# Altium project UAV_States.PrjPcb
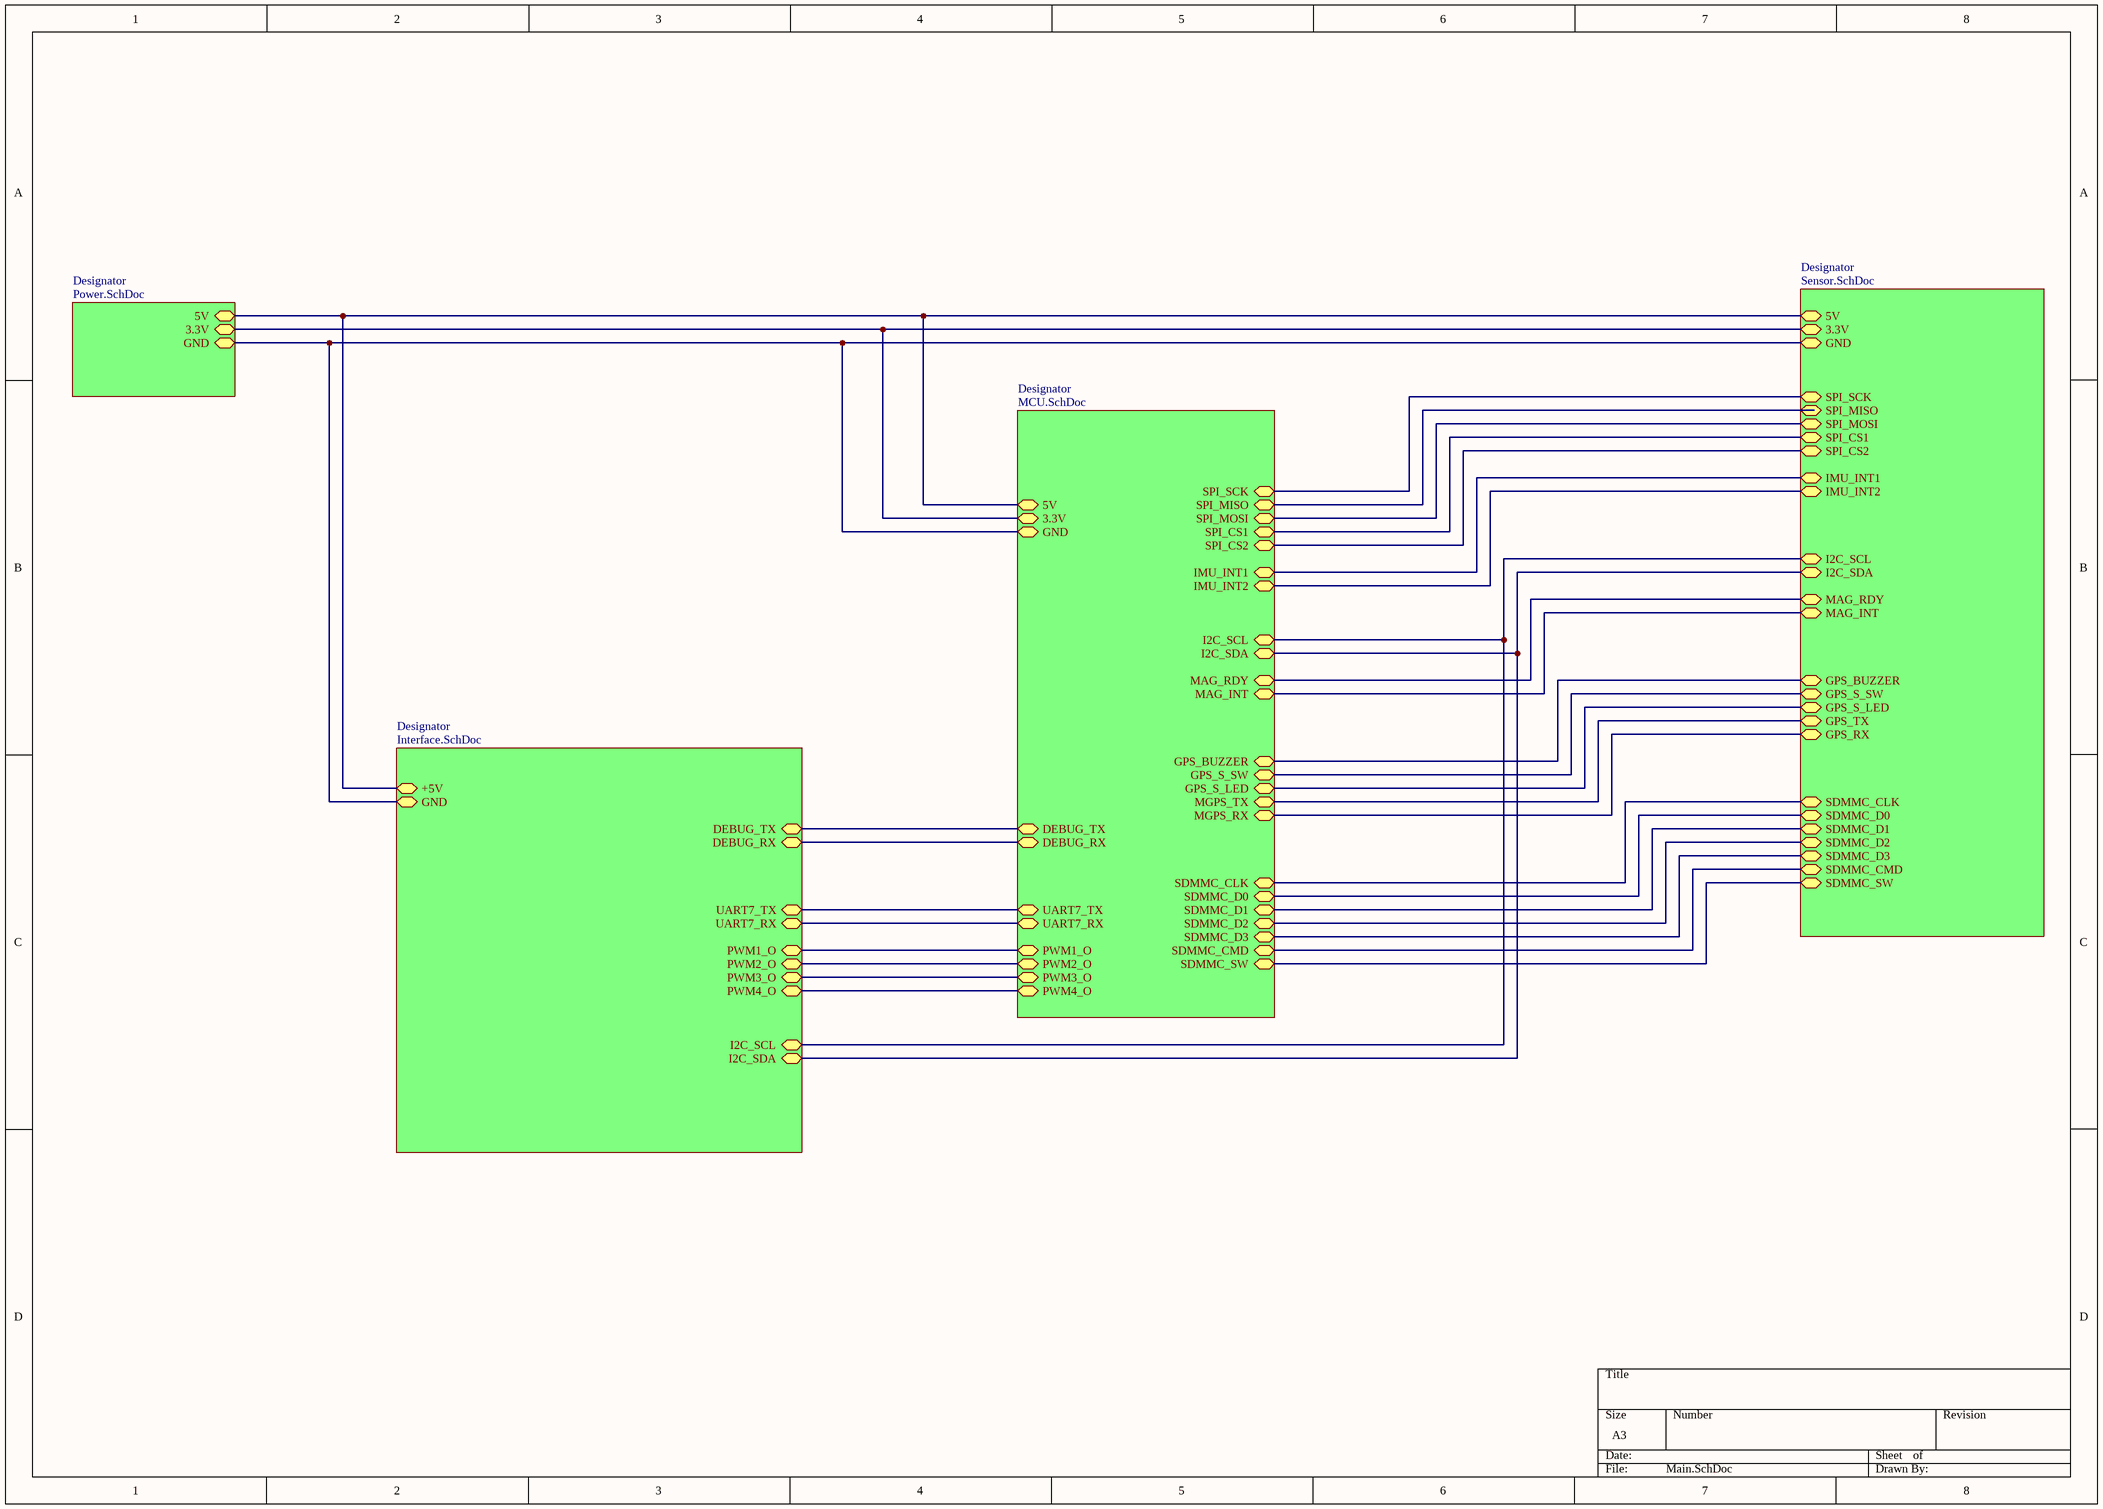
[diagram p0: Main.SchDoc]
5 sheets, 89 parts. Net scope: hierarchical (ports join the sheet entries above them; power ports are global).
Board file: UAV_States_PCB.PcbDoc
Sheets:
  Main.SchDoc
    Designator = MCU.SchDoc
    Designator = Power.SchDoc
    Designator = Sensor.SchDoc
    Designator = Interface.SchDoc

## Sheet Main.SchDoc
size A3; SheetNumber: 1; SheetTotal: 5

### Sub-sheets
Designator = MCU.SchDoc: IMU_INT2 (bidir), MGPS_RX (bidir), MGPS_TX (bidir), MAG_RDY (bidir), MAG_INT (bidir), GND (bidir), 3.3V (bidir), 5V (bidir), SPI_CS1 (bidir), SPI_SCK (bidir), SPI_MISO (bidir), SPI_MOSI (bidir), I2C_SDA (bidir), I2C_SCL (bidir), UART7_RX (bidir), GPS_BUZZER (bidir), UART7_TX (bidir), GPS_S_SW (bidir), DEBUG_TX (bidir), DEBUG_RX (bidir), SPI_CS2 (bidir), IMU_INT1 (bidir), GPS_S_LED (bidir), SDMMC_D0 (bidir), SDMMC_D1 (bidir), SDMMC_CLK (bidir), SDMMC_D3 (bidir), SDMMC_D2 (bidir), SDMMC_CMD (bidir), SDMMC_SW (bidir), PWM3_O (bidir), PWM4_O (bidir), PWM1_O (bidir), PWM2_O (bidir)
Designator = Power.SchDoc: GND (bidir), 3.3V (bidir), 5V (bidir)
Designator = Sensor.SchDoc: MAG_INT (bidir), SPI_MOSI (bidir), SPI_MISO (bidir), IMU_INT2 (bidir), I2C_SCL (bidir), SPI_SCK (bidir), I2C_SDA (bidir), MAG_RDY (bidir), GPS_TX (bidir), GPS_RX (bidir), SPI_CS2 (bidir), 5V (bidir), GND (bidir), 3.3V (bidir), GPS_S_SW (bidir), GPS_S_LED (bidir), GPS_BUZZER (bidir), SDMMC_CLK (bidir), SDMMC_D0 (bidir), SDMMC_D1 (bidir), SDMMC_D2 (bidir), SDMMC_D3 (bidir), SDMMC_CMD (bidir), SDMMC_SW (bidir), SPI_CS1 (bidir), IMU_INT1 (bidir)
Designator = Interface.SchDoc: GND (bidir), DEBUG_TX (bidir), DEBUG_RX (bidir), UART7_TX (bidir), UART7_RX (bidir), I2C_SDA (bidir), I2C_SCL (bidir), PWM1_O (bidir), PWM2_O (bidir), PWM3_O (bidir), PWM4_O (bidir), +5V (bidir)

### Nets
3.3V: sheet Designator/3.3V, sheet Designator/3.3V, sheet Designator/3.3V
+5V: sheet Designator/5V, sheet Designator/5V, sheet Designator/5V, sheet Designator/+5V
GND: sheet Designator/GND, sheet Designator/GND, sheet Designator/GND, sheet Designator/GND
Buzzer: sheet Designator/GPS_BUZZER, sheet Designator/GPS_BUZZER
DEBUG_RX: sheet Designator/DEBUG_RX, sheet Designator/DEBUG_RX
DEBUG_TX: sheet Designator/DEBUG_TX, sheet Designator/DEBUG_TX
GPS_RX: sheet Designator/MGPS_RX, sheet Designator/GPS_RX
GPS_S_LED: sheet Designator/GPS_S_LED, sheet Designator/GPS_S_LED
GPS_S_SW: sheet Designator/GPS_S_SW, sheet Designator/GPS_S_SW
GPS_TX: sheet Designator/MGPS_TX, sheet Designator/GPS_TX
I2C_SCL: sheet Designator/I2C_SCL, sheet Designator/I2C_SCL, sheet Designator/I2C_SCL
I2C_SDA: sheet Designator/I2C_SDA, sheet Designator/I2C_SDA, sheet Designator/I2C_SDA
IMU_INT1: sheet Designator/IMU_INT1, sheet Designator/IMU_INT1
IMU_INT2: sheet Designator/IMU_INT2, sheet Designator/IMU_INT2
MAG_INT: sheet Designator/MAG_INT, sheet Designator/MAG_INT
MAG_RDY: sheet Designator/MAG_RDY, sheet Designator/MAG_RDY
PWM1_O: sheet Designator/PWM1_O, sheet Designator/PWM1_O
PWM2_O: sheet Designator/PWM2_O, sheet Designator/PWM2_O
PWM3_O: sheet Designator/PWM3_O, sheet Designator/PWM3_O
PWM4_O: sheet Designator/PWM4_O, sheet Designator/PWM4_O
SDMMC_CLK: sheet Designator/SDMMC_CLK, sheet Designator/SDMMC_CLK
SDMMC_CMD: sheet Designator/SDMMC_CMD, sheet Designator/SDMMC_CMD
SDMMC_D0: sheet Designator/SDMMC_D0, sheet Designator/SDMMC_D0
SDMMC_D1: sheet Designator/SDMMC_D1, sheet Designator/SDMMC_D1
SDMMC_D2: sheet Designator/SDMMC_D2, sheet Designator/SDMMC_D2
SDMMC_D3: sheet Designator/SDMMC_D3, sheet Designator/SDMMC_D3
SDMMC_SW: sheet Designator/SDMMC_SW, sheet Designator/SDMMC_SW
SPI1_CS: sheet Designator/SPI_CS1, sheet Designator/SPI_CS1
SPI1_CS2: sheet Designator/SPI_CS2, sheet Designator/SPI_CS2
SPI1_MISO: sheet Designator/SPI_MISO, sheet Designator/SPI_MISO
SPI1_MOSI: sheet Designator/SPI_MOSI, sheet Designator/SPI_MOSI
SPI1_SCK: sheet Designator/SPI_SCK, sheet Designator/SPI_SCK
UART7_RX_O: sheet Designator/UART7_RX, sheet Designator/UART7_RX
UART7_TX_O: sheet Designator/UART7_TX, sheet Designator/UART7_TX

## Sheet MCU.SchDoc
size A3; SheetNumber: 3; SheetTotal: 5
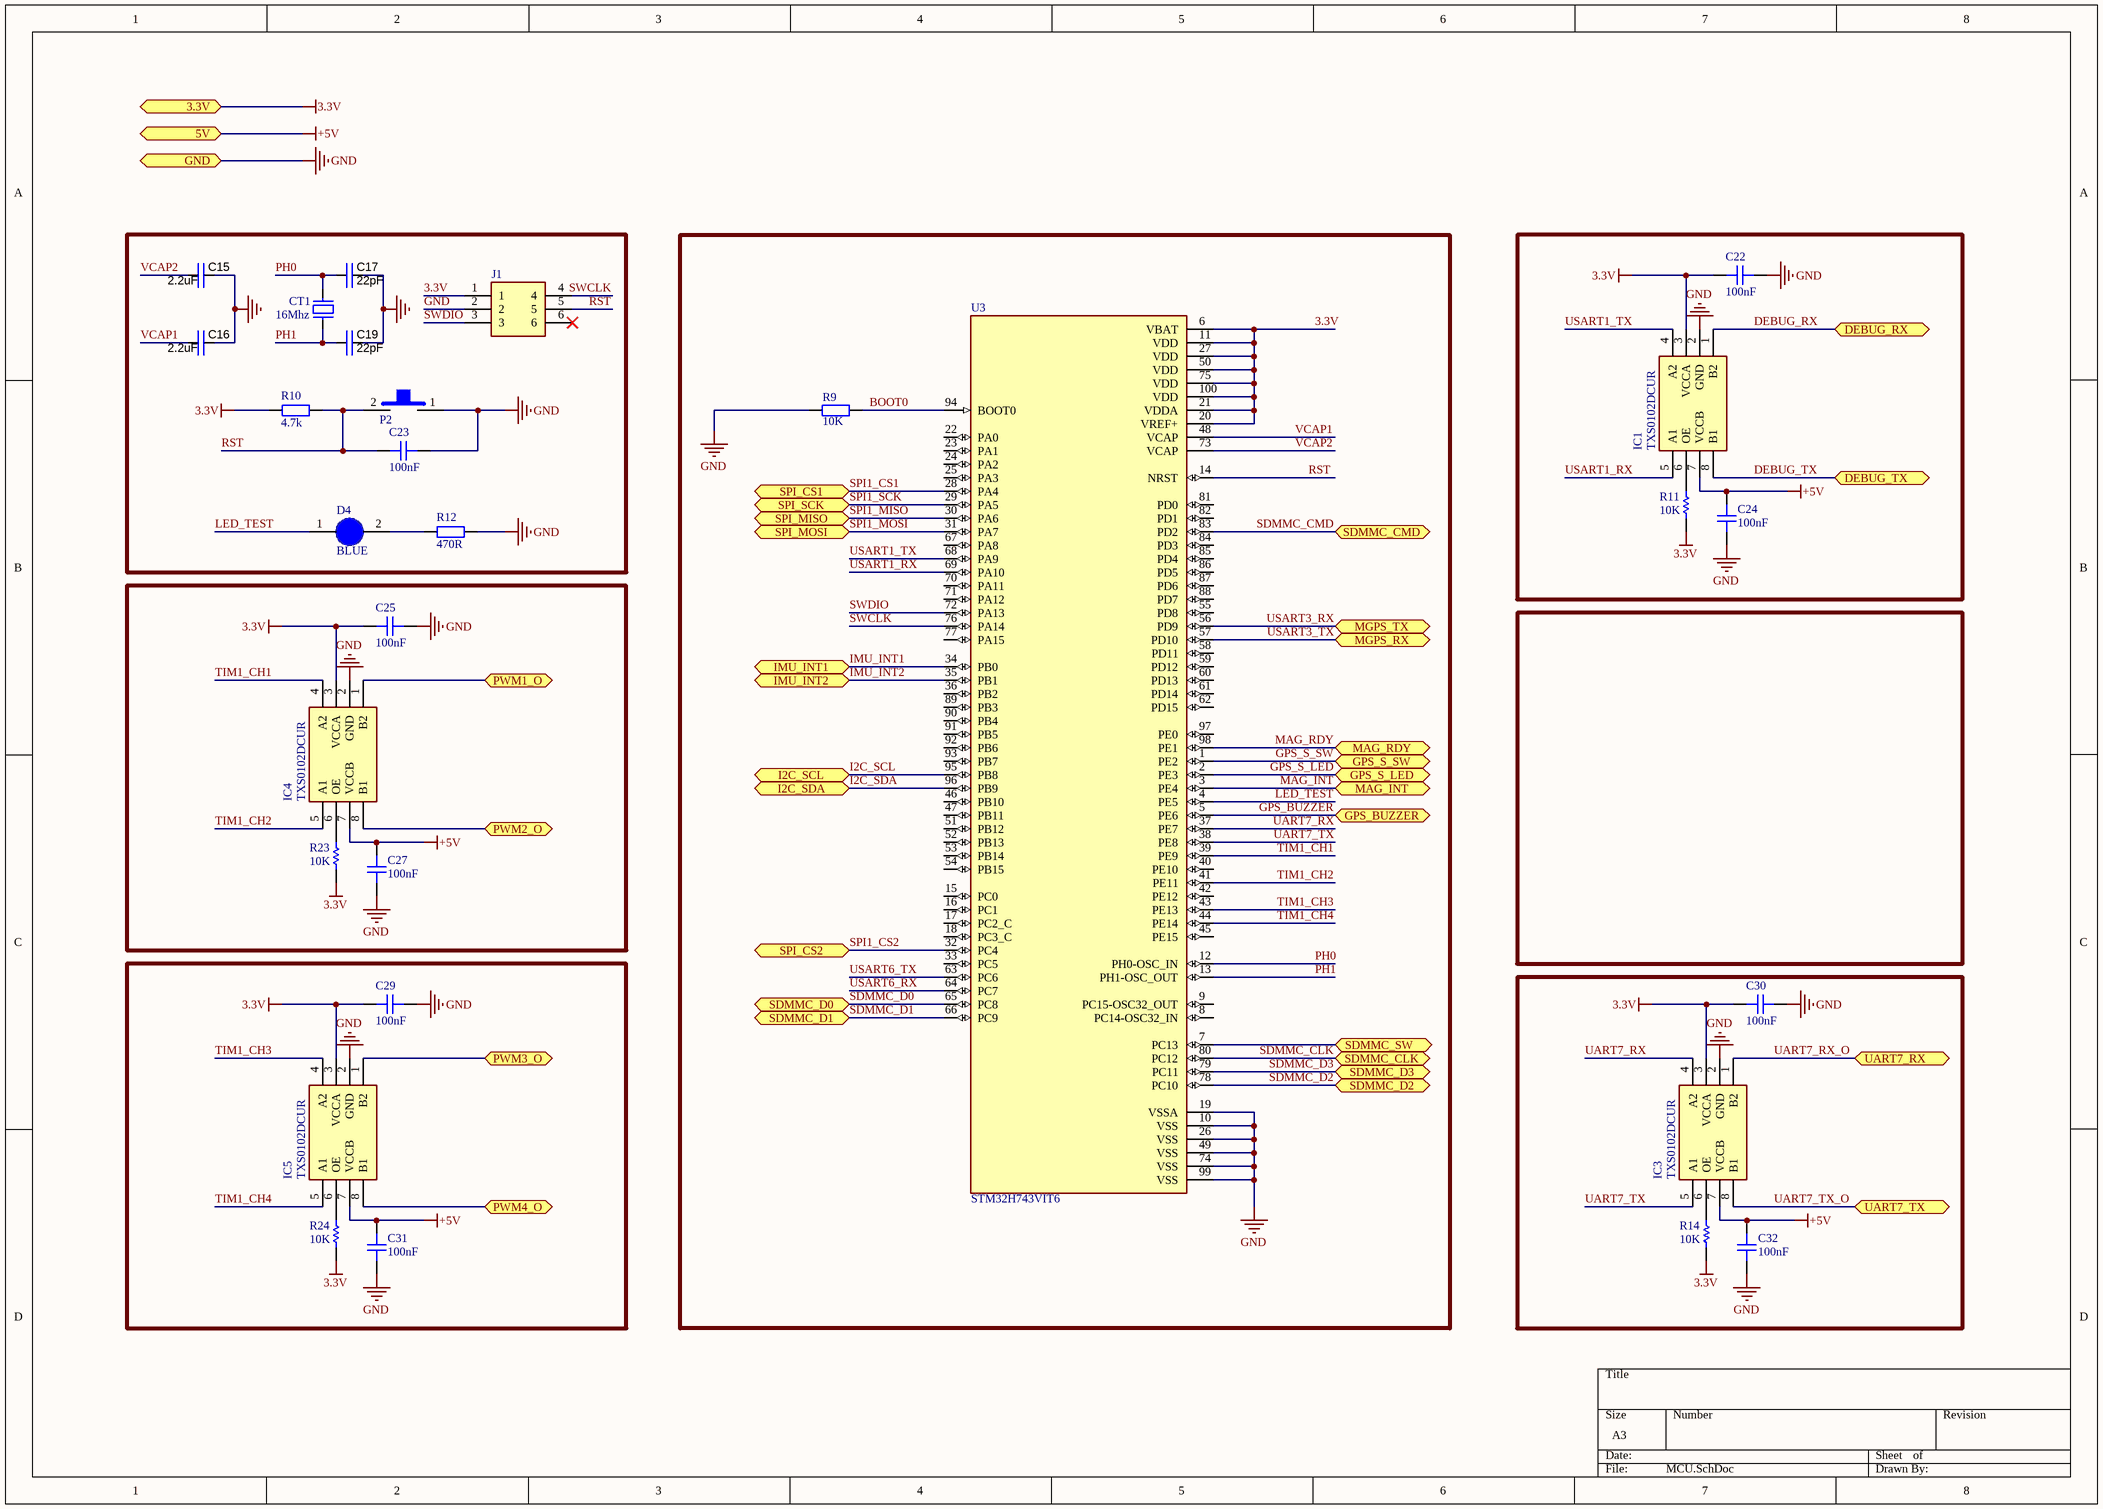
[diagram p1: MCU.SchDoc]

### Parts
C15  value 2.2uF  [CAPC-0402 (0506)]  (hidden comment: Tụ gốm)
C16  value 2.2uF  [CAPC-0402 (0506)]  (hidden comment: Tụ gốm)
C17  22pF  [CAPC-0402 (1005)]
C19  22pF  [CAPC-0402 (1005)]
C22  100nF  [CAP_0402]
C23  100nF  [CAP_0402]
C24  100nF  [CAP_0402]
C25  100nF  [CAP_0402]
C27  100nF  [CAP_0402]
C29  100nF  [CAP_0402]
C30  100nF  [CAP_0402]
C31  100nF  [CAP_0402]
C32  100nF  [CAP_0402]
CT1  16Mhz  [CRYSTAL-SMD5032]
D4  BLUE  [LED_0603_BLUE]
IC1  TXS0102DCUR  [TXS0102DCUR]
IC3  TXS0102DCUR  [TXS0102DCUR]
IC4  TXS0102DCUR  [TXS0102DCUR]
IC5  TXS0102DCUR  [TXS0102DCUR]
J1  SM06B-SRSS-TB__LF__SN_  [SM06B-SRSS-TB]  (value not drawn)
P2  (no value)  [SW 2P SMD]
R9  10K  [RESC-0402 (1005)]
R10  4.7k  [RESC-0402 (1005)]
R11  10K  [RESC-0402 (1005)]
R12  470R  [RESC-0402 (1005)]
R14  10K  [RESC-0402 (1005)]
R23  10K  [RESC-0402 (1005)]
R24  10K  [RESC-0402 (1005)]
U3  STM32H743VIT6  [QFP50P1600X1600X160-100N]

### Ports
3.3V (bidir), 5V (bidir), DEBUG_RX (bidir), DEBUG_TX (bidir), GND (bidir), GPS_BUZZER (bidir), GPS_S_LED (bidir), GPS_S_SW (bidir), I2C_SCL (bidir), I2C_SDA (bidir), IMU_INT1 (bidir), IMU_INT2 (bidir), MAG_INT (bidir), MAG_RDY (bidir), MGPS_RX (bidir), MGPS_TX (bidir), PWM1_O (bidir), PWM2_O (bidir), PWM3_O (bidir), PWM4_O (bidir), SDMMC_CLK (bidir), SDMMC_CMD (bidir), SDMMC_D0 (bidir), SDMMC_D1 (bidir), SDMMC_D2 (bidir), SDMMC_D3 (bidir), SDMMC_SW (bidir), SPI_CS1 (bidir), SPI_CS2 (bidir), SPI_MISO (bidir), SPI_MOSI (bidir), SPI_SCK (bidir), UART7_RX (bidir), UART7_TX (bidir)

### Nets
3.3V: C22.2 C25.2 C29.2 C30.2 IC1.3(VCCA) IC3.3(VCCA) IC4.3(VCCA) IC5.3(VCCA) J1.1 R10.2 R11.1 R14.1 R23.1 R24.1 U3.6(VBAT) U3.11(VDD) U3.20(VREF+) U3.21(VDDA) U3.27(VDD) U3.50(VDD) U3.75(VDD) U3.100(VDD) ; port 3.3V
+5V: C24.2 C27.2 C31.2 C32.2 IC1.7(VCCB) IC3.7(VCCB) IC4.7(VCCB) IC5.7(VCCB) ; port 5V
GND: C15.2 C16.2 C17.2 C19.2 C22.1 C23.1 C24.1 C25.1 C27.1 C29.1 C30.1 C31.1 C32.1 IC1.2(GND) IC3.2(GND) IC4.2(GND) IC5.2(GND) J1.2 P2.1 R9.1 R12.1 U3.10(VSS) U3.19(VSSA) U3.26(VSS) U3.49(VSS) U3.74(VSS) U3.99(VSS) ; port GND
BOOT0: R9.2 U3.94(BOOT0)
DEBUG_RX: IC1.1(B2) ; port DEBUG_RX
DEBUG_TX: IC1.8(B1) ; port DEBUG_TX
GPS_BUZZER: U3.5(PE6) ; port GPS_BUZZER  [project net Buzzer]
GPS_S_LED: U3.2(PE3) ; port GPS_S_LED
GPS_S_SW: U3.1(PE2) ; port GPS_S_SW
I2C_SCL: U3.95(PB8) ; port I2C_SCL
I2C_SDA: U3.96(PB9) ; port I2C_SDA
IMU_INT1: U3.34(PB0) ; port IMU_INT1
IMU_INT2: U3.35(PB1) ; port IMU_INT2
LED_TEST: D4.1(A) U3.4(PE5)
MAG_INT: U3.3(PE4) ; port MAG_INT
MAG_RDY: U3.98(PE1) ; port MAG_RDY
PH0: C17.1 CT1.2 U3.12(PH0-OSC_IN)
PH1: C19.1 CT1.1 U3.13(PH1-OSC_OUT)
PWM1_O: IC4.1(B2) ; port PWM1_O
PWM2_O: IC4.8(B1) ; port PWM2_O
PWM3_O: IC5.1(B2) ; port PWM3_O
PWM4_O: IC5.8(B1) ; port PWM4_O
RST: C23.2 J1.5 P2.2 R10.1 U3.14(NRST)
SDMMC_CLK: U3.80(PC12) ; port SDMMC_CLK
SDMMC_CMD: U3.83(PD2) ; port SDMMC_CMD
SDMMC_D0: U3.65(PC8) ; port SDMMC_D0
SDMMC_D1: U3.66(PC9) ; port SDMMC_D1
SDMMC_D2: U3.78(PC10) ; port SDMMC_D2
SDMMC_D3: U3.79(PC11) ; port SDMMC_D3
SDMMC_SW: U3.7(PC13) ; port SDMMC_SW
SPI1_CS1: U3.28(PA4) ; port SPI_CS1  [project net SPI1_CS]
SPI1_CS2: U3.32(PC4) ; port SPI_CS2
SPI1_MISO: U3.30(PA6) ; port SPI_MISO
SPI1_MOSI: U3.31(PA7) ; port SPI_MOSI
SPI1_SCK: U3.29(PA5) ; port SPI_SCK
SWCLK: J1.4 U3.76(PA14)
SWDIO: J1.3 U3.72(PA13)
TIM1_CH1: IC4.4(A2) U3.39(PE9)
TIM1_CH2: IC4.5(A1) U3.41(PE11)
TIM1_CH3: IC5.4(A2) U3.43(PE13)
TIM1_CH4: IC5.5(A1) U3.44(PE14)
UART7_RX: IC3.4(A2) U3.37(PE7)
UART7_RX_O: IC3.1(B2) ; port UART7_RX
UART7_TX: IC3.5(A1) U3.38(PE8)
UART7_TX_O: IC3.8(B1) ; port UART7_TX
USART1_RX: IC1.5(A1) U3.69(PA10)
USART1_TX: IC1.4(A2) U3.68(PA9)
USART3_RX: U3.56(PD9) ; port MGPS_TX  [project net GPS_TX]
USART3_TX: U3.57(PD10) ; port MGPS_RX  [project net GPS_RX]
USART6_RX: U3.64(PC7)
USART6_TX: U3.63(PC6)
VCAP1: C16.1 U3.48(VCAP)
VCAP2: C15.1 U3.73(VCAP)
NetD4_2: D4.2(K) R12.2
NetIC1_6: IC1.6(OE) R11.2
NetIC3_6: IC3.6(OE) R14.2
NetIC4_6: IC4.6(OE) R23.2
NetIC5_6: IC5.6(OE) R24.2

Not connected (* = marked no-connect by the designer): J1 6*; U3 8(PC14-OSC32_IN) 9(PC15-OSC32_OUT) 15(PC0) 16(PC1) 17(PC2_C) 18(PC3_C) 22(PA0) 23(PA1) 24(PA2) 25(PA3) 33(PC5) 36(PB2) 40(PE10) 42(PE12) 45(PE15) 46(PB10) 47(PB11) 51(PB12) 52(PB13) 53(PB14) 54(PB15) 55(PD8) 58(PD11) 59(PD12) 60(PD13) 61(PD14) 62(PD15) 67(PA8) 70(PA11) 71(PA12) 77(PA15) 81(PD0) 82(PD1) 84(PD3) 85(PD4) 86(PD5) 87(PD6) 88(PD7) 89(PB3) 90(PB4) 91(PB5) 92(PB6) 93(PB7) 97(PE0)

### Library data of the parts
C15-C17 C19 = CAP C_0603: Capacitor SMD Cer 470nF 10% 16V X7R 0603; Manufacturer 1: Murata Electronics North America; Manufacturer Part Number 1: GRM188R71C474KA88D; Ratings: 16V; X7R; Material: ceramic; SCDType: spec; Package / Case: 0603 (1608 metric); Tolerance: ±10%; Manufacturer 2: TDK Corporation; Manufacturer Part Number 2: C1608X7R1C474K; Supplier 1: Digi-Key; Supplier Part Number 1: 490-3295-2-ND; Supplier 2: Digi-Key; Supplier Part Number 2: 445-5192-2-ND; Supplier 3: Digi-Key; Supplier Part Number 3: 587-1250-2-ND; Manufacturer 3: Taiyo Yuden; Manufacturer Part Number 3: EMK107B7474KA-T; Manufacturer 4: Samsung; Manufacturer Part Number 4: CL10B474KONE; ComponentLink1URL: http://psearch.murata.com/capacitor/product/GRM188R71C474KA88#.pdf; ComponentLink1Description: http://psearch.murata.com/capacitor/product/GRM188R71C474KA88#.pdf; ComponentLink2URL: http://product.tdk.com/capacitor/mlcc/en/documents/mlcc_commercial_general_en.pdf; ComponentLink2Description: http://product.tdk.com/capacitor/mlcc/en/documents/mlcc_commercial_general_en.pdf; ComponentLink3URL: http://www.yuden.co.jp/or/product/category/capacitor/EMK107B7474KA-T.pdf; ComponentLink3Description: http://www.yuden.co.jp/or/product/category/capacitor/EMK107B7474KA-T.pdf
  C17 C19: Value: 22pF
C22-C25 C27 C29-C32 = CAP_0402: 0402 100nF 16V X7R; Manufacturer: *; Manufacturer Part Number: *; Distributor Link: *; LCSC: *; Rating: *; Dielectric: *
CT1 = CRYSTAL: CL = 16 - 18pF; Value: 4Mhz
D4 = LED BLUE 0603: LED BLUE 0603 SMD; Solder: SMT; Value: BLUE; Category: *
IC1 IC3-IC5 = TXS0102DCUR: Integrated Circuit; Manufacturer_Name: Texas Instruments; Datasheet Link: https://datasheet.datasheetarchive.com/originals/distributors/SFDatasheet-7/sf-000145437.pdf; Height: 0.9mm; Manufacturer_Part_Number: TXS0102DCUR; Mouser Part Number: 595-TXS0102DCUR; Mouser Price/Stock: https://www.mouser.co.uk/ProductDetail/Texas-Instruments/TXS0102DCUR?qs=dB0LedT%252BmmBcQ3I%2Fs9XEDA%3D%3D; Arrow Part Number: TXS0102DCUR; Arrow Price/Stock: https://www.arrow.com/en/products/txs0102dcur/texas-instruments?region=nac
J1 = SM06B-SRSS-TB__LF__SN_: Connector; Manufacturer_Name: JST (JAPAN SOLDERLESS TERMINALS); Manufacturer_Part_Number: SM06B-SRSS-TB (LF)(SN); Datasheet Link: http://uk.rs-online.com/web/p/products/5468827
P2 = Button 2 SMD: SMD Mini Push Button Switch 2 Pin 3x6x2.7mm; MPN: SMD Mini Push Button 2 SMD; Link: https://ram-e-shop.com/product/press2pin-smd/
R9 = RC0603FR-0710KL: RES SMD 10K OHM 1% 1/10W 0603; CompanyID: VT-00328; Solder: SMT; MPN: RC0603FR-0710KL; Value: 10K; Category: RESISTOR
R10 = Tro 0603 5% 4.7k: Dán; Don_Vi: Con; So_Chan: 2; Ten_Linh_Kien: Trở 0603 5% 4.7k; Ma_Hang: MH006327; Chung_Loai: Dán; Kieu_Chan: *
R11 R14 R23 R24 = Res Semi: Semiconductor Resistor; Value: 1K; Published: 8-Jun-2000; LatestRevisionDate: 17-Jul-2002; LatestRevisionNote: Re-released for DXP Platform.; PackageReference: AXIAL-0.5; Publisher: Altium Limited; PackageDescription: Axial Device, Thru-Hole; 2 Leads; 0.5 in Pin Spacing
R12 = Tro 0603 5% 470R: Dán; Don_Vi: Con; So_Chan: 2; Ten_Linh_Kien: Trở 0603 5% 470R; Ma_Hang: MH006328; Chung_Loai: Dán; Kieu_Chan: *
U3 = STM32H743VIT6: ARMÂ® CortexÂ®-M7 STM32H7 Microcontroller IC 32-Bit Single-Core 480MHz 2MB (2M x 8) FLASH 100-LQFP (14x14); MF: STMicroelectronics; SnapEDA_Link: https://www.snapeda.com/parts/STM32H743VIT6/STMicroelectronics/view-part/?ref=snap; Package: LQFP-100 STMicroelectronics; Value: *; MP: STM32H743VIT6; Check_prices: https://www.snapeda.com/parts/STM32H743VIT6/STMicroelectronics/view-part/?ref=eda

## Sheet Power.SchDoc
size A3; SheetNumber: 2; SheetTotal: 5
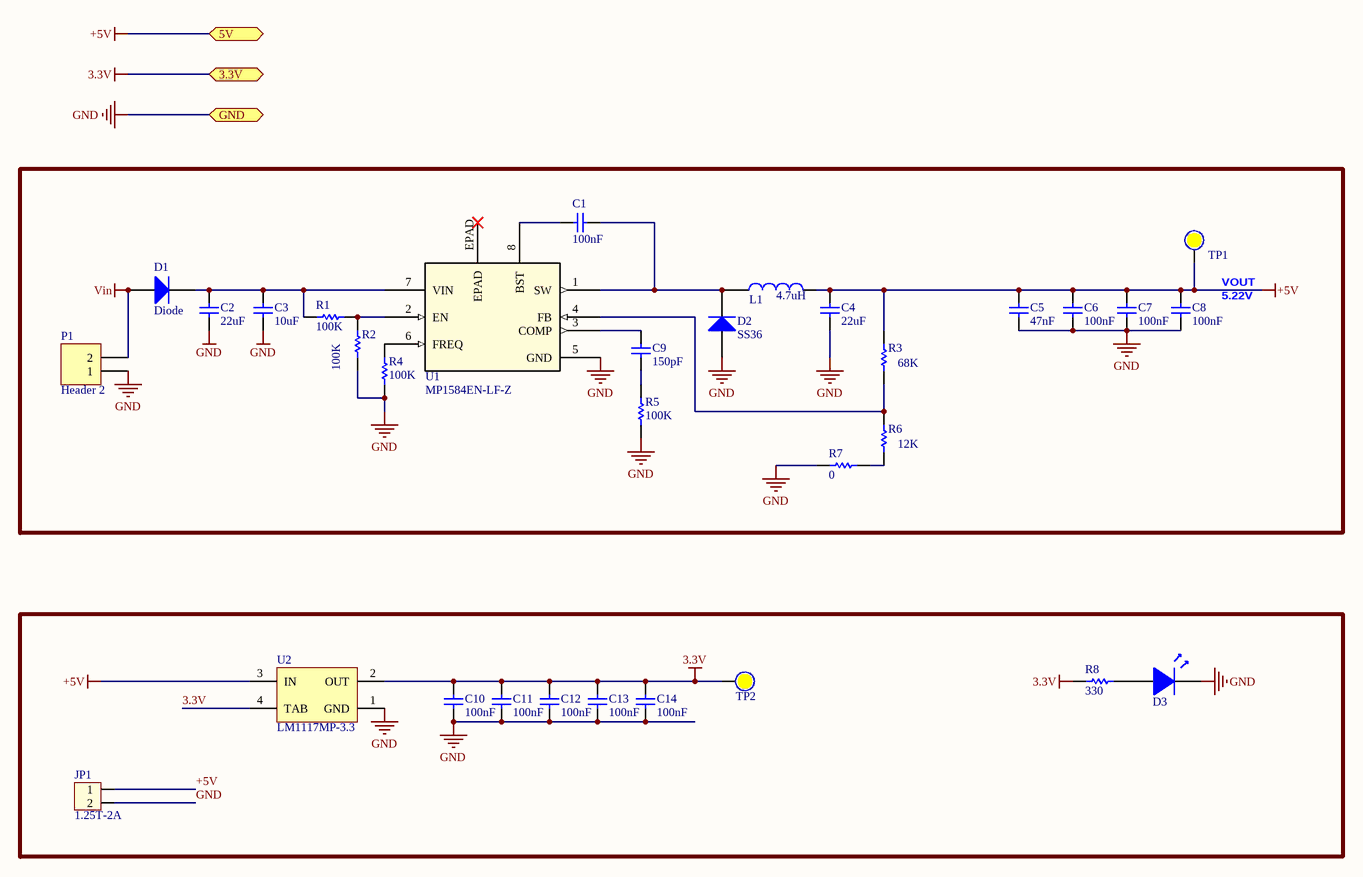
[diagram p2: Power.SchDoc]

### Parts
C1  100nF  [CAPC-0402 (0506)]
C2  22uF  [2012[0805]]
C3  10uF  [2012[0805]]
C4  22uF  [2012[0805]]
C5  47nF  [2012[0805]]
C6  100nF  [CAPC-0402 (0506)]
C7  100nF  [CAPC-0402 (0506)]
C8  100nF  [CAPC-0402 (0506)]
C9  150pF  [1005[0402]]
C10  100nF  [CAPC-0402 (0506)]
C11  100nF  [CAPC-0402 (0506)]
C12  100nF  [CAPC-0402 (0506)]
C13  100nF  [CAPC-0402 (0506)]
C14  100nF  [CAPC-0402 (0506)]
D1  Diode  [DIODE SMD]
D2  SS36  [SMB]
D3  LED  [LED_0603_BLUE]  (value not drawn)
JP1  1.25T-2A  [BM02B-GHS]
L1  4.7uH  [INDUCTOR SMD 7x7]
P1  Header 2  [BM02B-GHS]
R1  100K  [1005[0402]]
R2  100K  [1005[0402]]
R3  68K  [1005[0402]]
R4  100K  [1005[0402]]
R5  100K  [1005[0402]]
R6  12K  [1005[0402]]
R7  0  [1005[0402]]
R8  330  [RESC-0402 (1005)]
TP1  (no value)  [Test Point 1 MM]  (no BOM)
TP2  (no value)  [Test Point 1 MM]  (no BOM)
U1  MP1584EN-LF-Z  [SOIC8E_MPS]
U2  LM1117MP-3.3  [MP04A_N]

### Ports
3.3V (bidir), 5V (bidir), GND (bidir)

### Nets
3.3V: C10.2 C11.2 C12.2 C13.2 C14.2 R8.2 TP2.0 U2.2(OUT) U2.4(TAB) ; port 3.3V
+5V: C4.2 C5.2 C6.2 C7.2 C8.2 JP1.1 L1.2 R3.2 TP1.0 U2.3(IN) ; port 5V
GND: C2.1 C3.1 C4.1 C5.1 C6.1 C7.1 C8.1 C10.1 C11.1 C12.1 C13.1 C14.1 D2.1(A) D3.2(K) JP1.2 P1.1 R2.1 R4.2 R5.2 R7.1 U1.5(GND) U2.1(GND) ; port GND
Vin: D1.1(A) P1.2
NetC1_1: C1.1 D2.2(K) L1.1 U1.1(SW)
NetC1_2: C1.2 U1.8(BST)
NetC2_2: C2.2 C3.2 D1.2(K) R1.2 U1.7(VIN)
NetC9_1: C9.1 R5.1
NetC9_2: C9.2 U1.3(COMP)
NetD3_1: D3.1(A) R8.1
NetR1_1: R1.1 R2.2 U1.2(EN)
NetR3_1: R3.1 R6.1 U1.4(FB)
NetR4_1: R4.1 U1.6(FREQ)
NetR6_2: R6.2 R7.2

Not connected (* = marked no-connect by the designer): U1 EPAD*

### Notes on the sheet
- 5.22V
- VOUT

### Library data of the parts
C1-C14 = TU THUONG
D2 = Diode: Default Diode; Published: 8-Jun-2000; LatestRevisionDate: 17-Jul-2002; LatestRevisionNote: Re-released for DXP Platform.; PackageDocument: Sep-1996; PackageReference: SMC; Publisher: Altium Limited; Code_JEDEC: DO-214-AB
JP1 = Header 1_2.54_2P: Cắm; Chung_Loai: Cắm
L1 = Inductor SMD
P1 = Header 2: Header, 2-Pin; LatestRevisionDate: 17-Jul-2002; LatestRevisionNote: Re-released for DXP Platform.; Publisher: Altium Limited
R1-R7 = Res1: Resistor; Value: 1k; Published: 8-Jun-2000; LatestRevisionDate: 17-Jul-2002; LatestRevisionNote: Re-released for DXP Platform.; PackageReference: AXIAL-0.3; Publisher: Altium Limited; PackageDescription: Axial Device, Thru-Hole; 2 Leads; 0.3 in Pin Spacing
R8 = Res Semi: Semiconductor Resistor; Published: 8-Jun-2000; LatestRevisionDate: 17-Jul-2002; LatestRevisionNote: Re-released for DXP Platform.; PackageReference: AXIAL-0.5; Publisher: Altium Limited; PackageDescription: Axial Device, Thru-Hole; 2 Leads; 0.5 in Pin Spacing; Value: 330
TP1 TP2 = Test Point: Solder: NF
U1 = MP1584EN-LF-Z: No Description Available; Mfr_Name: Monolithic Power Systems; Copyright: Copyright (C) 2023 Ultra Librarian. All rights reserved.; Manufacturer_Part_Number: MP1584EN-LF-Z; RefDes: RefDes; Type: DEV
U2 = LM1117MP-3.3: 800mA Low-Dropout Linear Regulator, 4-pin SOT-223; Manufacturer: National Semiconductor; PackageTopMarking: XYTT*N05A; PowerWise: N; CompType: LDO IC; Published: 4-Dec-2008; DatasheetVersion: Apr-2006; PackageVersion: revB, Apr-2003; PackageReference: MP04A; Publisher: Altium Limited; PackageDescription: Molded SOT-223, 6.50 x 3.56 x 1.6mm Body, 4 Lead, 2.3mm Pitch; Supplier 1: Farnell; Supplier Part Number 1: 9778195; Supplier 2: Farnell; Supplier Part Number 2: 9778195RL; PartNumber: LM1117MP-3.3; RoHS: N; PinCount: 4; Code_JEDEC: TO-261-AA; Code_IPC: SOT223-4; ComponentLink1Description: LM1117 Datasheet; ComponentLink1URL: http://www.national.com/ds/LM/LM1117.pdf; ComponentLink2Description: LM1117 Web Page; ComponentLink2URL: http://www.national.com/pf/LM/LM1117.html; ComponentLink3Description: MP04A Package Page; ComponentLink3URL: http://www.national.com/packaging/folders/mp04a.html

## Sheet Sensor.SchDoc
size A3; SheetNumber: 4; SheetTotal: 5
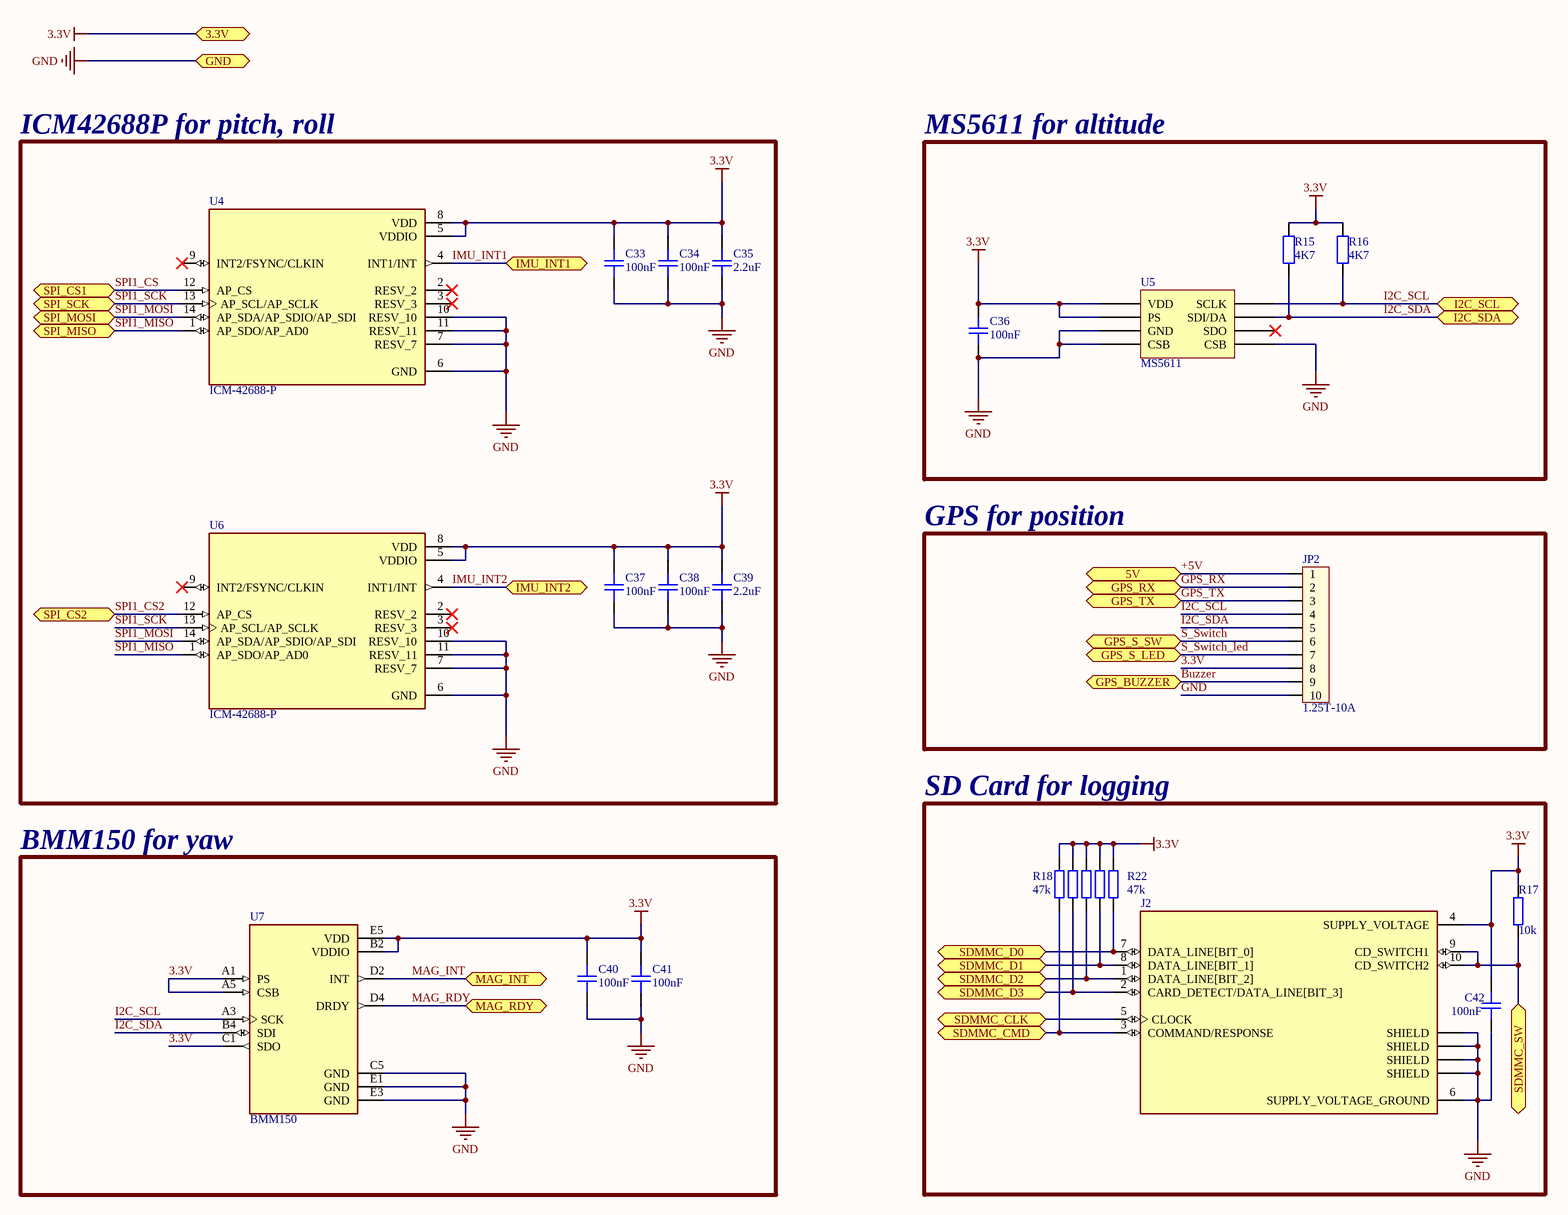
[diagram p3: Sensor.SchDoc]

### Parts
C33  100nF  [CAP_0402]
C34  100nF  [CAP_0402]
C35  2.2uF  [CAP_0603]
C36  100nF  [CAP_0402]
C37  100nF  [CAP_0402]
C38  100nF  [CAP_0402]
C39  2.2uF  [CAP_0603]
C40  100nF  [CAP_0402]
C41  100nF  [CAP_0402]
C42  100nF  [CAP_0402]
J2  (no value)  [AMPHENOL_1140084168]
JP2  1.25T-10A  [BM10B-GHS-TBT]
R15  4K7  [RESC-0402 (1005)]
R16  4K7  [RESC-0402 (1005)]
R17  10k  [RES_0402]
R18  47k  [RES_0402]
R19  47k  [RES_0402]  (value not drawn)
R20  47k  [RES_0402]  (value not drawn)
R21  47k  [RES_0402]  (value not drawn)
R22  47k  [RES_0402]
U4  ICM-42688-P  [PQFN50P300X250X97-14N]
U5  MS5611  [MS5611_1]
U6  ICM-42688-P  [PQFN50P300X250X97-14N]
U7  BMM150  [XDCR_BMM150]

### Blocks framed on the sheet
ICM42688P for pitch, roll: C33-C35 C37-C39 U4 U6
MS5611 for altitude: C36 R15 R16 U5
GPS for position: JP2
SD Card for logging: C42 J2 R17-R22
BMM150 for yaw: C40 C41 U7

### Ports
3.3V (bidir), 5V (bidir), GND (bidir), GPS_BUZZER (bidir), GPS_RX (bidir), GPS_S_LED (bidir), GPS_S_SW (bidir), GPS_TX (bidir), I2C_SCL (bidir), I2C_SDA (bidir), IMU_INT1 (bidir), IMU_INT2 (bidir), MAG_INT (bidir), MAG_RDY (bidir), SDMMC_CLK (bidir), SDMMC_CMD (bidir), SDMMC_D0 (bidir), SDMMC_D1 (bidir), SDMMC_D2 (bidir), SDMMC_D3 (bidir), SDMMC_SW (bidir), SPI_CS1 (bidir), SPI_CS2 (bidir), SPI_MISO (bidir), SPI_MOSI (bidir), SPI_SCK (bidir)

### Nets
3.3V: C33.2 C34.2 C35.2 C36.2 C37.2 C38.2 C39.2 C40.2 C41.2 C42.2 J2.4(SUPPLY_VOLTAGE) JP2.8 R15.2 R16.2 R17.2 R18.2 R19.2 R20.2 R21.2 R22.2 U4.5(VDDIO) U4.8(VDD) U5.128(VDD) U5.129(PS) U6.5(VDDIO) U6.8(VDD) U7.A1(PS) U7.A5(CSB) U7.B2(VDDIO) U7.C1(SDO) U7.E5(VDD) ; port 3.3V
+5V: JP2.1 ; port 5V
GND: C33.1 C34.1 C35.1 C36.1 C37.1 C38.1 C39.1 C40.1 C41.1 C42.1 J2.6(SUPPLY_VOLTAGE_GROUND) J2.S1(SHIELD) J2.S2(SHIELD) J2.S3(SHIELD) J2.S4(SHIELD) JP2.10 U4.6(GND) U4.7(RESV_7) U4.10(RESV_10) U4.11(RESV_11) U5.130(GND) U5.131(CSB) U5.132(CSB) U6.6(GND) U6.7(RESV_7) U6.10(RESV_10) U6.11(RESV_11) U7.C5(GND) U7.E1(GND) U7.E3(GND) ; port GND
Buzzer: JP2.9 ; port GPS_BUZZER
GPS_RX: JP2.2 ; port GPS_RX
GPS_TX: JP2.3 ; port GPS_TX
I2C_SCL: JP2.4 R16.1 U5.135(SCLK) U7.A3(SCK) ; port I2C_SCL
I2C_SDA: JP2.5 R15.1 U5.134(SDI/DA) U7.B4(SDI) ; port I2C_SDA
IMU_INT1: U4.4(INT1/INT) ; port IMU_INT1
IMU_INT2: U6.4(INT1/INT) ; port IMU_INT2
MAG_INT: U7.D2(INT) ; port MAG_INT
MAG_RDY: U7.D4(DRDY) ; port MAG_RDY
S_Switch: JP2.6 ; port GPS_S_SW  [project net GPS_S_SW]
S_Switch_led: JP2.7 ; port GPS_S_LED  [project net GPS_S_LED]
SDMMC_CLK: J2.5(CLOCK) ; port SDMMC_CLK
SDMMC_CMD: J2.3(COMMAND/RESPONSE) R18.1 ; port SDMMC_CMD
SDMMC_D0: J2.7(DATA_LINE[BIT_0]) R22.1 ; port SDMMC_D0
SDMMC_D1: J2.8(DATA_LINE[BIT_1]) R21.1 ; port SDMMC_D1
SDMMC_D2: J2.1(DATA_LINE[BIT_2]) R20.1 ; port SDMMC_D2
SDMMC_D3: J2.2(CARD_DETECT/DATA_LINE[BIT_3]) R19.1 ; port SDMMC_D3
SDMMC_SW: J2.9(CD_SWITCH1) J2.10(CD_SWITCH2) R17.1 ; port SDMMC_SW
SPI1_CS: U4.12(AP_CS) ; port SPI_CS1
SPI1_CS2: U6.12(AP_CS) ; port SPI_CS2
SPI1_MISO: U4.1(AP_SDO/AP_AD0) U6.1(AP_SDO/AP_AD0) ; port SPI_MISO
SPI1_MOSI: U4.14(AP_SDA/AP_SDIO/AP_SDI) U6.14(AP_SDA/AP_SDIO/AP_SDI) ; port SPI_MOSI
SPI1_SCK: U4.13(AP_SCL/AP_SCLK) U6.13(AP_SCL/AP_SCLK) ; port SPI_SCK

Not connected (* = marked no-connect by the designer): U4 2(RESV_2)* 3(RESV_3)* 9(INT2/FSYNC/CLKIN)*; U5 133(SDO)*; U6 2(RESV_2)* 3(RESV_3)* 9(INT2/FSYNC/CLKIN)*

### Library data of the parts
C33 C34 C36-C38 C40-C42 = CAP_0402: 0402 100nF 16V X7R; Manufacturer: *; Manufacturer Part Number: *; Distributor Link: *; LCSC: *; Rating: *; Dielectric: *
C35 C39 = CAP_0603: 0603 2.2uF 10V X7R; Manufacturer: *; Manufacturer Part Number: *; Distributor Link: *; LCSC: *; Rating: *; Dielectric: *
J2 = 1140084168: MEMORY CARD CONNECTOR, MICROSD, 8 POSITION, FULL REEL; Memory / Card Type:MicroSD; Insert & Eject Mechanism:Push-Pull; No. of Contacts:8Contacts; Contact Material:Copper Alloy; Contact Plating:Gold Plated Contacts; Product Range:- RoHS Compliant: Yes; MF: amphenol communications solutions; MP: 114-00841-68..; SnapEDA_Link: https://www.snapeda.com/parts/114-00841-68../Amphenol/view-part/?ref=snap; Package: None; Value: *; Check_prices: https://www.snapeda.com/parts/114-00841-68../Amphenol/view-part/?ref=eda
JP2 = Header 1_2.54_10P: Cắm; Don_Vi: Con; Chung_Loai: Cắm
R15 R16 = RC0603FR-074K7L: RES SMD 4.7K OHM 1% 1/10W 0603; CompanyID: VT-00327; Solder: SMT; MPN: RC0603FR-074K7L; Value: 4K7; Category: RESISTOR
R17-R22 = RES_0402: Resistor SMD 0402; Manufacturer: *; Manufacturer Part Number: *; Distributor Link: *; LCSC: *
U4 U6 = ICM-42688-P: Accelerometer, Gyroscope, 6 Axis Sensor Output; Package: None; MP: ICM-42688-P; Value: *; Availability: Unavailable; Price: None
U5 = MS5611: pin to pad: 128>1 129>2 130>3 131>4 132>5 133>6 134>7 135>8
U7 = BMM150: FlipCore, Hall Effect Sensor X, Y, Z Axis 12-WLCSP (1.56x1.56); MF: Bosch Sensortec; SnapEDA_Link: https://www.snapeda.com/parts/BMM150/Bosch/view-part/?ref=snap; Package: WLCSP-12 Bosch; Value: *; MP: BMM150; Check_prices: https://www.snapeda.com/parts/BMM150/Bosch/view-part/?ref=eda

## Sheet Interface.SchDoc
size A3; SheetNumber: 5; SheetTotal: 5
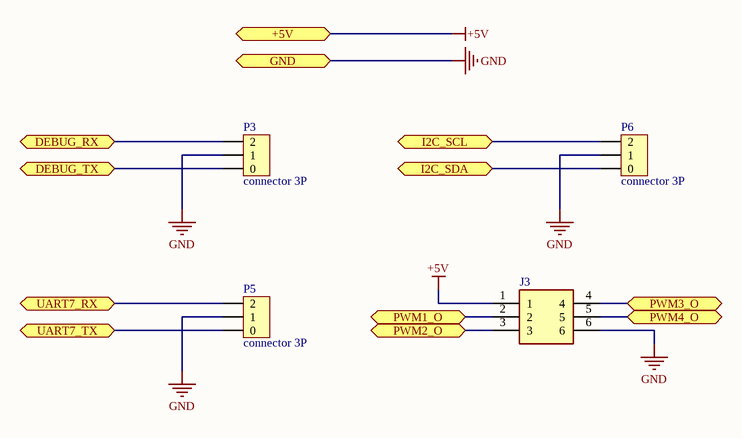
[diagram p4: Interface.SchDoc]

### Parts
J3  SM06B-SRSS-TB__LF__SN_  [SM06B-SRSS-TB]  (value not drawn)
P3  connector 3P  [GH-3AB]
P5  connector 3P  [GH-3AB]
P6  connector 3P  [GH-3AB]

### Ports
+5V (bidir), DEBUG_RX (bidir), DEBUG_TX (bidir), GND (bidir), I2C_SCL (bidir), I2C_SDA (bidir), PWM1_O (bidir), PWM2_O (bidir), PWM3_O (bidir), PWM4_O (bidir), UART7_RX (bidir), UART7_TX (bidir)

### Nets
+5V: J3.1 ; port +5V
GND: J3.6 P3.1 P5.1 P6.1 ; port GND
DEBUG_RX: P3.2 ; port DEBUG_RX
DEBUG_TX: P3.0 ; port DEBUG_TX
I2C_SCL: P6.2 ; port I2C_SCL
I2C_SDA: P6.0 ; port I2C_SDA
PWM1_O: J3.2 ; port PWM1_O
PWM2_O: J3.3 ; port PWM2_O
PWM3_O: J3.4 ; port PWM3_O
PWM4_O: J3.5 ; port PWM4_O
UART7_RX_O: P5.2 ; port UART7_RX
UART7_TX_O: P5.0 ; port UART7_TX

### Library data of the parts
J3 = SM06B-SRSS-TB__LF__SN_: as J1 on sheet MCU; Datasheet Link: http://uk.rs-online.com/web/p/products/5468827

## Nets that join several sheets
3.3V: MCU (22 pins), Power (9 pins), Sensor (31 pins)
+5V: MCU (8 pins), Power (10 pins), Sensor (JP2.1), Interface (J3.1)
GND: MCU (27 pins), Power (22 pins), Sensor (30 pins), Interface (J3.6 P3.1 P5.1 P6.1)
Buzzer: MCU (U3.5), Sensor (JP2.9)
DEBUG_RX: MCU (IC1.1), Interface (P3.2)
DEBUG_TX: MCU (IC1.8), Interface (P3.0)
GPS_RX: MCU (U3.57), Sensor (JP2.2)
GPS_S_LED: MCU (U3.2), Sensor (JP2.7)
GPS_S_SW: MCU (U3.1), Sensor (JP2.6)
GPS_TX: MCU (U3.56), Sensor (JP2.3)
I2C_SCL: MCU (U3.95), Sensor (JP2.4 R16.1 U5.135 U7.A3), Interface (P6.2)
I2C_SDA: MCU (U3.96), Sensor (JP2.5 R15.1 U5.134 U7.B4), Interface (P6.0)
IMU_INT1: MCU (U3.34), Sensor (U4.4)
IMU_INT2: MCU (U3.35), Sensor (U6.4)
MAG_INT: MCU (U3.3), Sensor (U7.D2)
MAG_RDY: MCU (U3.98), Sensor (U7.D4)
PWM1_O: MCU (IC4.1), Interface (J3.2)
PWM2_O: MCU (IC4.8), Interface (J3.3)
PWM3_O: MCU (IC5.1), Interface (J3.4)
PWM4_O: MCU (IC5.8), Interface (J3.5)
SDMMC_CLK: MCU (U3.80), Sensor (J2.5)
SDMMC_CMD: MCU (U3.83), Sensor (J2.3 R18.1)
SDMMC_D0: MCU (U3.65), Sensor (J2.7 R22.1)
SDMMC_D1: MCU (U3.66), Sensor (J2.8 R21.1)
SDMMC_D2: MCU (U3.78), Sensor (J2.1 R20.1)
SDMMC_D3: MCU (U3.79), Sensor (J2.2 R19.1)
SDMMC_SW: MCU (U3.7), Sensor (J2.9 J2.10 R17.1)
SPI1_CS: MCU (U3.28), Sensor (U4.12)
SPI1_CS2: MCU (U3.32), Sensor (U6.12)
SPI1_MISO: MCU (U3.30), Sensor (U4.1 U6.1)
SPI1_MOSI: MCU (U3.31), Sensor (U4.14 U6.14)
SPI1_SCK: MCU (U3.29), Sensor (U4.13 U6.13)
UART7_RX_O: MCU (IC3.1), Interface (P5.2)
UART7_TX_O: MCU (IC3.8), Interface (P5.0)